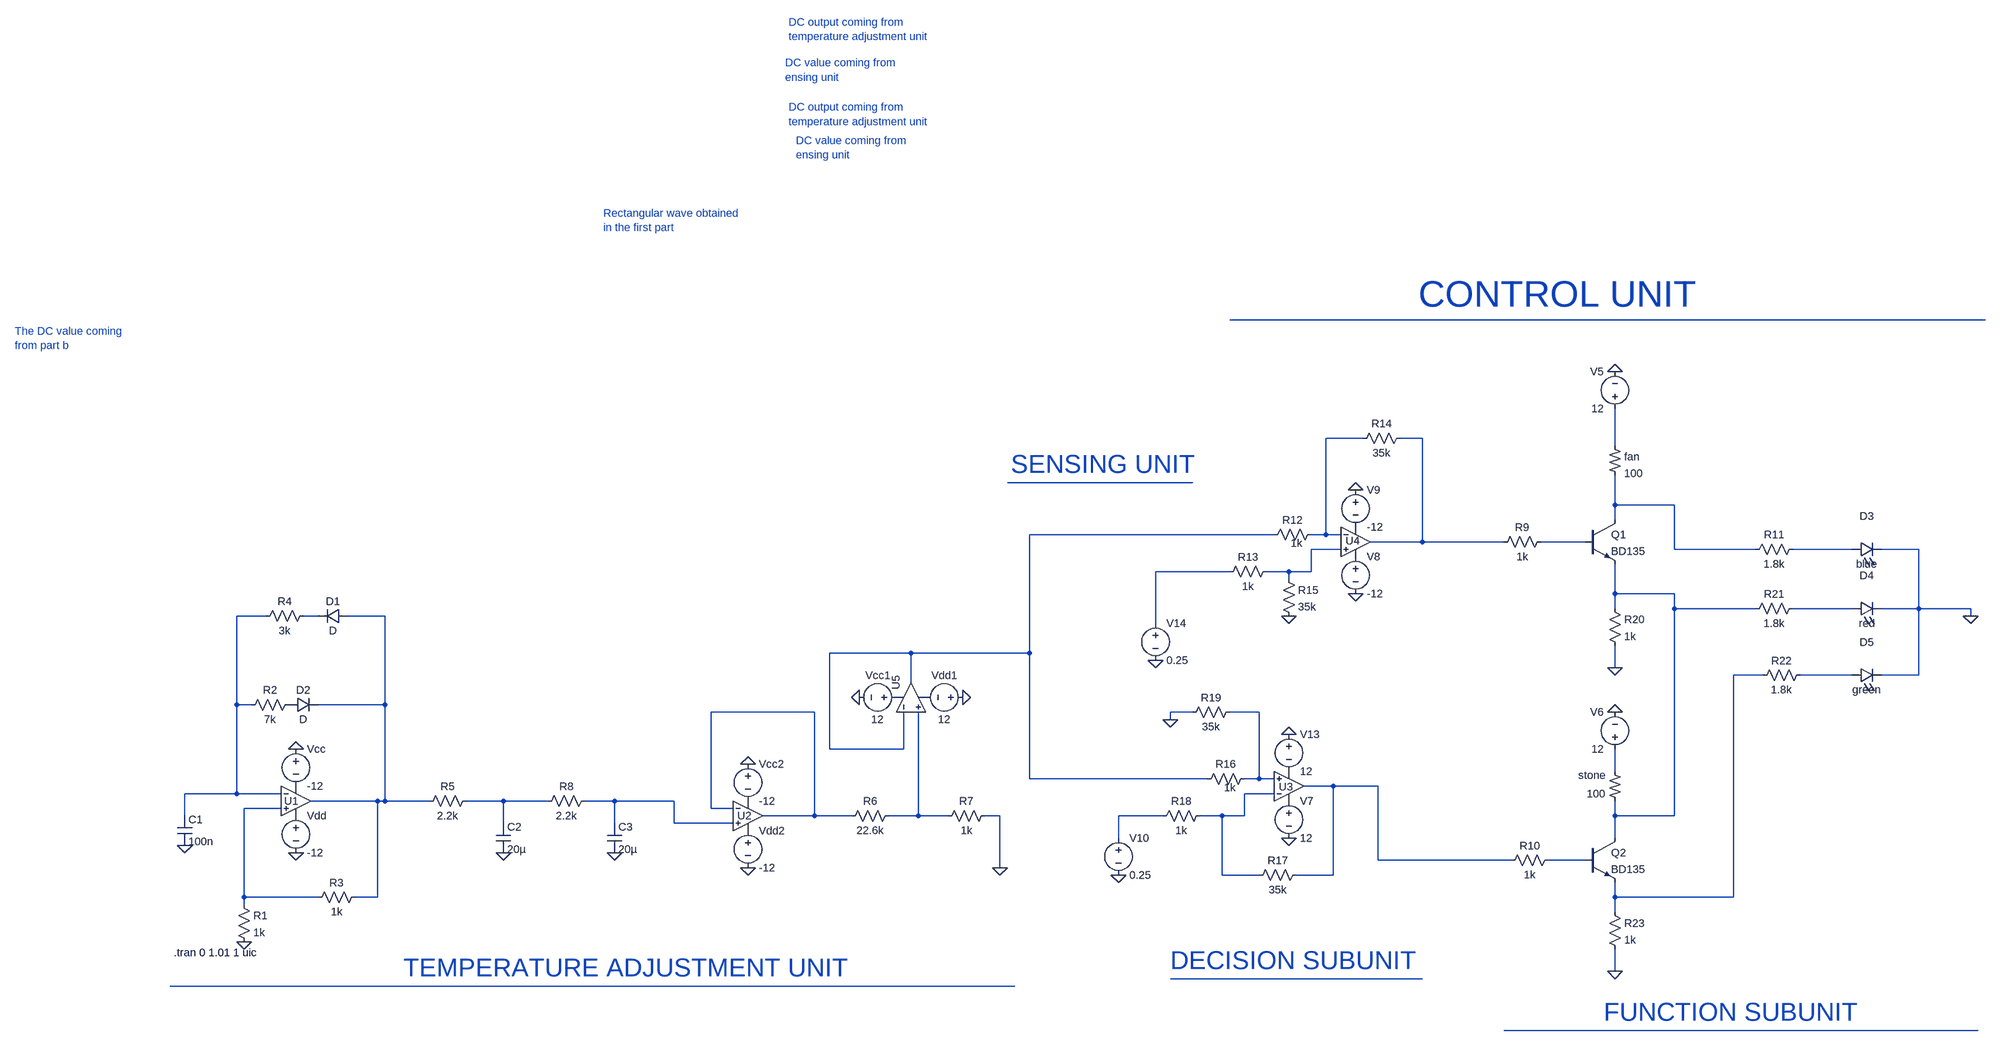
[diagram p0: schematic 213-project-neartheend.asc]
213-project-neartheend.asc, the LTspice schematic file:
Version 4
SHEET 1 5204 696
WIRE 3472 -1136 1840 -1136
WIRE 2128 -880 2048 -880
WIRE 2256 -880 2208 -880
WIRE 2672 -864 2672 -944
WIRE 1760 -784 1360 -784
WIRE 2672 -736 2672 -800
WIRE 2800 -736 2672 -736
WIRE 2672 -704 2672 -736
WIRE 1936 -672 1408 -672
WIRE 2048 -672 2048 -880
WIRE 2048 -672 2016 -672
WIRE 2080 -672 2048 -672
WIRE 2256 -656 2256 -880
WIRE 2256 -656 2144 -656
WIRE 2432 -656 2256 -656
WIRE 2608 -656 2512 -656
WIRE 2080 -640 2016 -640
WIRE 2800 -640 2800 -736
WIRE 2976 -640 2800 -640
WIRE 3184 -640 3056 -640
WIRE 3328 -640 3248 -640
WIRE 1840 -592 1680 -592
WIRE 1968 -592 1920 -592
WIRE 2016 -592 2016 -640
WIRE 2016 -592 1968 -592
WIRE 1968 -576 1968 -592
WIRE 2672 -544 2672 -608
WIRE 2800 -544 2672 -544
WIRE 2672 -512 2672 -544
WIRE 2800 -512 2800 -544
WIRE 2976 -512 2800 -512
WIRE 3184 -512 3056 -512
WIRE 3328 -512 3328 -640
WIRE 3328 -512 3248 -512
WIRE 3440 -512 3328 -512
WIRE -240 -496 -304 -496
WIRE -128 -496 -160 -496
WIRE 16 -496 -64 -496
WIRE 3440 -496 3440 -512
WIRE 1680 -480 1680 -592
WIRE 1152 -416 976 -416
WIRE 1408 -416 1408 -672
WIRE 1408 -416 1152 -416
WIRE 2672 -384 2672 -432
WIRE 2992 -368 2928 -368
WIRE 3184 -368 3072 -368
WIRE 3328 -368 3328 -512
WIRE 3328 -368 3248 -368
WIRE 1152 -352 1152 -416
WIRE -304 -304 -304 -496
WIRE -272 -304 -304 -304
WIRE 16 -304 16 -496
WIRE 16 -304 -128 -304
WIRE 944 -288 720 -288
WIRE 1760 -288 1712 -288
WIRE 1904 -288 1840 -288
WIRE 1712 -272 1712 -288
WIRE 976 -208 976 -416
WIRE 1136 -208 1136 -288
WIRE 1136 -208 976 -208
WIRE 2672 -160 2672 -208
WIRE 1408 -144 1408 -416
WIRE 1792 -144 1408 -144
WIRE 1904 -144 1904 -288
WIRE 1904 -144 1872 -144
WIRE 1936 -144 1904 -144
WIRE 2064 -128 2000 -128
WIRE 2160 -128 2064 -128
WIRE -304 -112 -304 -304
WIRE -304 -112 -416 -112
WIRE -208 -112 -304 -112
WIRE 1936 -112 1872 -112
WIRE 0 -96 -144 -96
WIRE 16 -96 16 -304
WIRE 16 -96 0 -96
WIRE 112 -96 16 -96
WIRE 272 -96 192 -96
WIRE 368 -96 272 -96
WIRE 512 -96 448 -96
WIRE 640 -96 512 -96
WIRE -208 -80 -288 -80
WIRE 720 -80 720 -288
WIRE 768 -80 720 -80
WIRE -416 -64 -416 -112
WIRE 944 -64 944 -288
WIRE 944 -64 832 -64
WIRE 1024 -64 944 -64
WIRE 1168 -64 1168 -288
WIRE 1168 -64 1104 -64
WIRE 1232 -64 1168 -64
WIRE 1344 -64 1312 -64
WIRE 1696 -64 1600 -64
WIRE 1824 -64 1776 -64
WIRE 1872 -64 1872 -112
WIRE 1872 -64 1824 -64
WIRE 2672 -64 2672 -96
WIRE 2800 -64 2800 -512
WIRE 2800 -64 2672 -64
WIRE 272 -48 272 -96
WIRE 512 -48 512 -96
WIRE 640 -48 640 -96
WIRE 768 -48 640 -48
WIRE 1600 -16 1600 -64
WIRE 2672 -16 2672 -64
WIRE 2160 32 2160 -128
WIRE 2448 32 2160 32
WIRE 2608 32 2528 32
WIRE 1344 48 1344 -64
WIRE 1824 64 1824 -64
WIRE 1904 64 1824 64
WIRE 2064 64 2064 -128
WIRE 2064 64 1984 64
WIRE -288 112 -288 -80
WIRE -128 112 -288 112
WIRE 0 112 0 -96
WIRE 0 112 -48 112
WIRE 2672 112 2672 80
WIRE 2928 112 2928 -368
WIRE 2928 112 2672 112
WIRE -288 128 -288 112
WIRE 2672 144 2672 112
WIRE 2672 272 2672 224
WIRE 2256 288 1712 288
WIRE 1376 304 -448 304
WIRE 3456 400 2432 400
FLAG -176 -208 0
FLAG -176 16 0
FLAG -288 208 0
FLAG -416 0 0
FLAG 272 16 0
FLAG 800 48 0
FLAG 800 -176 0
FLAG 1344 48 0
FLAG 512 16 0
FLAG 2112 -768 0
FLAG 2112 -544 0
FLAG 1600 64 0
FLAG 1040 -320 0
FLAG 1264 -320 0
FLAG 2672 -1024 0
FLAG 2672 -384 0
FLAG 2672 272 0
FLAG 2672 -288 0
FLAG 1968 -240 0
FLAG 1968 -16 0
FLAG 1680 -400 0
FLAG 1968 -496 0
FLAG 3440 -496 0
FLAG 1712 -272 0
SYMBOL Opamps\\UniversalOpamp2 -176 -96 R0
WINDOW 0 -25 0 Left 2
SYMATTR InstName U1
SYMBOL voltage -176 -80 R0
WINDOW 123 0 0 Left 2
WINDOW 39 0 0 Left 2
SYMATTR InstName Vdd
SYMATTR Value -12
SYMBOL voltage -176 -224 R0
WINDOW 123 0 0 Left 2
WINDOW 39 0 0 Left 2
SYMATTR InstName Vcc
SYMATTR Value -12
SYMBOL cap -432 -64 R0
SYMATTR InstName C1
SYMATTR Value 100n
SYMBOL res -304 112 R0
SYMATTR InstName R1
SYMATTR Value 1k
SYMBOL res -176 -320 R90
WINDOW 0 0 56 VBottom 2
WINDOW 3 32 56 VTop 2
SYMATTR InstName R2
SYMATTR Value 7k
SYMBOL res -32 96 R90
WINDOW 0 0 56 VBottom 2
WINDOW 3 32 56 VTop 2
SYMATTR InstName R3
SYMATTR Value 1k
SYMBOL diode -64 -512 R90
WINDOW 0 0 32 VBottom 2
WINDOW 3 32 32 VTop 2
SYMATTR InstName D1
SYMBOL diode -192 -288 R270
WINDOW 0 32 32 VTop 2
WINDOW 3 0 32 VBottom 2
SYMATTR InstName D2
SYMBOL res -144 -512 R90
WINDOW 0 0 56 VBottom 2
WINDOW 3 32 56 VTop 2
SYMATTR InstName R4
SYMATTR Value 3k
SYMBOL res 208 -112 R90
WINDOW 0 0 56 VBottom 2
WINDOW 3 32 56 VTop 2
SYMATTR InstName R5
SYMATTR Value 2.2k
SYMBOL cap 256 -48 R0
SYMATTR InstName C2
SYMATTR Value 20µ
SYMBOL Opamps\\UniversalOpamp2 800 -64 R0
WINDOW 0 -23 0 Left 2
SYMATTR InstName U2
SYMBOL voltage 800 -48 R0
WINDOW 123 0 0 Left 2
WINDOW 39 0 0 Left 2
SYMATTR InstName Vdd2
SYMATTR Value -12
SYMBOL voltage 800 -192 R0
WINDOW 123 0 0 Left 2
WINDOW 39 0 0 Left 2
SYMATTR InstName Vcc2
SYMATTR Value -12
SYMBOL res 1120 -80 R90
WINDOW 0 0 56 VBottom 2
WINDOW 3 32 56 VTop 2
SYMATTR InstName R6
SYMATTR Value 22.6k
SYMBOL res 1328 -80 R90
WINDOW 0 0 56 VBottom 2
WINDOW 3 32 56 VTop 2
SYMATTR InstName R7
SYMATTR Value 1k
SYMBOL res 464 -112 R90
WINDOW 0 0 56 VBottom 2
WINDOW 3 32 56 VTop 2
SYMATTR InstName R8
SYMATTR Value 2.2k
SYMBOL cap 496 -48 R0
SYMATTR InstName C3
SYMATTR Value 20µ
SYMBOL Opamps\\UniversalOpamp2 2112 -656 R0
WINDOW 0 -22 -2 Left 2
SYMATTR InstName U4
SYMBOL res 2032 -688 R90
WINDOW 0 0 56 VBottom 2
WINDOW 3 19 47 VTop 2
SYMATTR InstName R12
SYMATTR Value 1k
SYMBOL voltage 2112 -640 R0
WINDOW 123 0 0 Left 2
WINDOW 39 0 0 Left 2
SYMATTR InstName V8
SYMATTR Value -12
SYMBOL voltage 2112 -784 R0
WINDOW 123 0 0 Left 2
WINDOW 39 0 0 Left 2
SYMATTR InstName V9
SYMATTR Value -12
SYMBOL res 2224 -896 R90
WINDOW 0 0 56 VBottom 2
WINDOW 3 32 56 VTop 2
SYMATTR InstName R14
SYMATTR Value 35k
SYMBOL res 1936 -608 R90
WINDOW 0 0 56 VBottom 2
WINDOW 3 32 56 VTop 2
SYMATTR InstName R13
SYMATTR Value 1k
SYMBOL voltage 1600 -32 R0
WINDOW 123 0 0 Left 2
WINDOW 39 0 0 Left 2
SYMATTR InstName V10
SYMATTR Value 0.25
SYMBOL npn 2608 -704 R0
SYMATTR InstName Q1
SYMATTR Value BD135
SYMBOL npn 2608 -16 R0
SYMATTR InstName Q2
SYMATTR Value BD135
SYMBOL Opamps\\UniversalOpamp2 1152 -320 R270
SYMATTR InstName U5
SYMBOL voltage 1136 -320 R90
WINDOW 0 -32 56 VBottom 2
WINDOW 3 32 56 VTop 2
WINDOW 123 0 0 Left 2
WINDOW 39 0 0 Left 2
SYMATTR InstName Vcc1
SYMATTR Value 12
SYMBOL voltage 1280 -320 R90
WINDOW 0 -32 56 VBottom 2
WINDOW 3 32 56 VTop 2
WINDOW 123 0 0 Left 2
WINDOW 39 0 0 Left 2
SYMATTR InstName Vdd1
SYMATTR Value 12
SYMBOL res 1952 -592 R0
SYMATTR InstName R15
SYMATTR Value 35k
SYMBOL res 2528 -672 R90
WINDOW 0 0 56 VBottom 2
WINDOW 3 32 56 VTop 2
SYMATTR InstName R9
SYMATTR Value 1k
SYMBOL res 2432 48 R270
WINDOW 0 32 56 VTop 2
WINDOW 3 0 56 VBottom 2
SYMATTR InstName R10
SYMATTR Value 1k
SYMBOL voltage 2672 -928 R180
WINDOW 0 24 96 Left 2
WINDOW 3 24 16 Left 2
WINDOW 123 0 0 Left 2
WINDOW 39 0 0 Left 2
SYMATTR InstName V5
SYMATTR Value 12
SYMBOL res2 2688 -96 R180
WINDOW 0 36 56 Left 2
WINDOW 3 36 16 Left 2
SYMATTR InstName stone
SYMATTR Value 100
SYMBOL voltage 2672 -192 R180
WINDOW 0 24 96 Left 2
WINDOW 3 24 16 Left 2
WINDOW 123 0 0 Left 2
WINDOW 39 0 0 Left 2
SYMATTR InstName V6
SYMATTR Value 12
SYMBOL Opamps\\UniversalOpamp2 1968 -128 M180
WINDOW 0 -22 -1 Left 2
SYMATTR InstName U3
SYMBOL res 1888 -160 R90
WINDOW 0 0 56 VBottom 2
WINDOW 3 19 47 VTop 2
SYMATTR InstName R16
SYMATTR Value 1k
SYMBOL voltage 1968 -112 R0
WINDOW 123 0 0 Left 2
WINDOW 39 0 0 Left 2
SYMATTR InstName V7
SYMATTR Value 12
SYMBOL voltage 1968 -256 R0
WINDOW 123 0 0 Left 2
WINDOW 39 0 0 Left 2
SYMATTR InstName V13
SYMATTR Value 12
SYMBOL res 1792 -80 R90
WINDOW 0 0 56 VBottom 2
WINDOW 3 32 56 VTop 2
SYMATTR InstName R18
SYMATTR Value 1k
SYMBOL voltage 1680 -496 R0
WINDOW 123 0 0 Left 2
WINDOW 39 0 0 Left 2
SYMATTR InstName V14
SYMATTR Value 0.25
SYMBOL res2 2656 -864 R0
SYMATTR InstName fan
SYMATTR Value 100
SYMBOL LED 3184 -624 R270
WINDOW 0 72 32 VTop 2
WINDOW 3 0 32 VBottom 2
SYMATTR InstName D3
SYMATTR Value blue
SYMBOL LED 3184 -496 R270
WINDOW 0 72 32 VTop 2
WINDOW 3 0 32 VBottom 2
SYMATTR InstName D4
SYMATTR Value red
SYMBOL LED 3184 -352 R270
WINDOW 0 72 32 VTop 2
WINDOW 3 0 32 VBottom 2
SYMATTR InstName D5
SYMATTR Value green
SYMBOL res 2656 -528 R0
SYMATTR InstName R20
SYMATTR Value 1k
SYMBOL res 3072 -656 R90
WINDOW 0 0 56 VBottom 2
WINDOW 3 32 56 VTop 2
SYMATTR InstName R11
SYMATTR Value 1.8k
SYMBOL res 3072 -528 R90
WINDOW 0 0 56 VBottom 2
WINDOW 3 32 56 VTop 2
SYMATTR InstName R21
SYMATTR Value 1.8k
SYMBOL res 3088 -384 R90
WINDOW 0 0 56 VBottom 2
WINDOW 3 32 56 VTop 2
SYMATTR InstName R22
SYMATTR Value 1.8k
SYMBOL res 2656 128 R0
SYMATTR InstName R23
SYMATTR Value 1k
SYMBOL res 2000 48 R90
WINDOW 0 0 56 VBottom 2
WINDOW 3 32 56 VTop 2
SYMATTR InstName R17
SYMATTR Value 35k
SYMBOL res 1856 -304 R90
WINDOW 0 0 56 VBottom 2
WINDOW 3 32 56 VTop 2
SYMATTR InstName R19
SYMATTR Value 35k
TEXT -440 232 Left 2 !.tran 0 1.01 1 uic
TEXT 488 -1912 Left 2 ;Rectangular wave obtained\nin the first part
TEXT -2128 -1112 Left 2 ;The DC value coming\nfrom part b
TEXT 888 -6232 Left 2 ;DC output coming from \ntemperature adjustment unit
TEXT 880 -6144 Left 2 ;DC value coming from\nensing unit
TEXT 888 -6048 Left 2 ;DC output coming from \ntemperature adjustment unit
TEXT 904 -5976 Left 2 ;DC value coming from\nensing unit
TEXT 56 264 Left 5 ;TEMPERATURE ADJUSTMENT UNIT
TEXT 1368 -824 Left 5 ;SENSING UNIT
TEXT 1712 248 Left 5 ;DECISION SUBUNIT
TEXT 2648 360 Left 5 ;FUNCTION SUBUNIT
TEXT 2248 -1192 Left 6 ;CONTROL UNIT

The netlist it stands for:
* 213-project-neartheend.asc
XU1 N026 N014 P001 P002 N016 level.2 Avol=1Meg GBW=10Meg Slew=10Meg ilimit=25m rail=0 Vos=0 phimargin=45 en=0 enk=0 in=0 ink=0 Rin=500Meg  ; pins IN+ IN- V+ V- OUT
Vdd P002 0 -12
Vcc 0 P001 -12
C1 N014 0 100n
R1 N026 0 1k
R2 P003 N014 7k
R3 N016 N026 1k
D1 N016 N015 D
D2 P003 N016 D
R4 N015 N014 3k
R5 N024 N016 2.2k
C2 N024 0 20µ
XU2 N025 N019 P004 P005 N019 level.2 Avol=1Meg GBW=10Meg Slew=10Meg ilimit=25m rail=0 Vos=0 phimargin=45 en=0 enk=0 in=0 ink=0 Rin=500Meg  ; pins IN+ IN- V+ V- OUT
Vdd2 P005 0 -12
Vcc2 0 P004 -12
R6 N027 N019 22.6k
R7 0 N027 1k
R8 N025 N024 2.2k
C3 N025 0 20µ
XU4 N009 N002 P006 P007 N003 level.2 Avol=1Meg GBW=10Meg Slew=10Meg ilimit=25m rail=0 Vos=0 phimargin=45 en=0 enk=0 in=0 ink=0 Rin=500Meg  ; pins IN+ IN- V+ V- OUT
R12 N002 N007 1k
V8 P007 0 -12
V9 0 P006 -12
R14 N003 N002 35k
R13 N009 N011 1k
V10 N028 0 0.25
Q1 N006 N008 N012 0 BD135
Q2 N012 N029 N017 0 BD135
XU5 N027 N007 P008 P009 N007 level.2 Avol=1Meg GBW=10Meg Slew=10Meg ilimit=25m rail=0 Vos=0 phimargin=45 en=0 enk=0 in=0 ink=0 Rin=500Meg  ; pins IN+ IN- V+ V- OUT
Vcc1 P008 0 12
Vdd1 0 P009 12
R15 N009 0 35k
R9 N008 N003 1k
R10 N022 N029 1k
V5 N004 0 12
R§stone N012 N021 100
V6 N021 0 12
XU3 N020 N023 P010 P011 N022 level.2 Avol=1Meg GBW=10Meg Slew=10Meg ilimit=25m rail=0 Vos=0 phimargin=45 en=0 enk=0 in=0 ink=0 Rin=500Meg  ; pins IN+ IN- V+ V- OUT
R16 N020 N007 1k
V7 P010 0 12
V13 0 P011 12
R18 N023 N028 1k
V14 N011 0 0.25
R§fan N004 N006 100
D3 N010 0 blue
D4 N013 0 red
D5 N018 0 green
R20 N012 0 1k
R11 N010 N006 1.8k
R21 N013 N012 1.8k
R22 N018 N017 1.8k
R23 N017 0 1k
R17 N022 N023 35k
R19 N020 0 35k
.model D D
.lib standard.dio
.model NPN NPN
.model PNP PNP
.lib standard.bjt
.tran 0 1.01 1 uic
* Rectangular wave obtained
* in the first part
* The DC value coming
* from part b
* DC output coming from
* temperature adjustment unit
* DC value coming from
* ensing unit
* DC output coming from
* temperature adjustment unit
* DC value coming from
* ensing unit
* TEMPERATURE ADJUSTMENT UNIT
* SENSING UNIT
* DECISION SUBUNIT
* FUNCTION SUBUNIT
* CONTROL UNIT
.lib UniversalOpamps2.sub
.backanno
.end